# Altium schematic sheet 电源.SchDoc
size A3
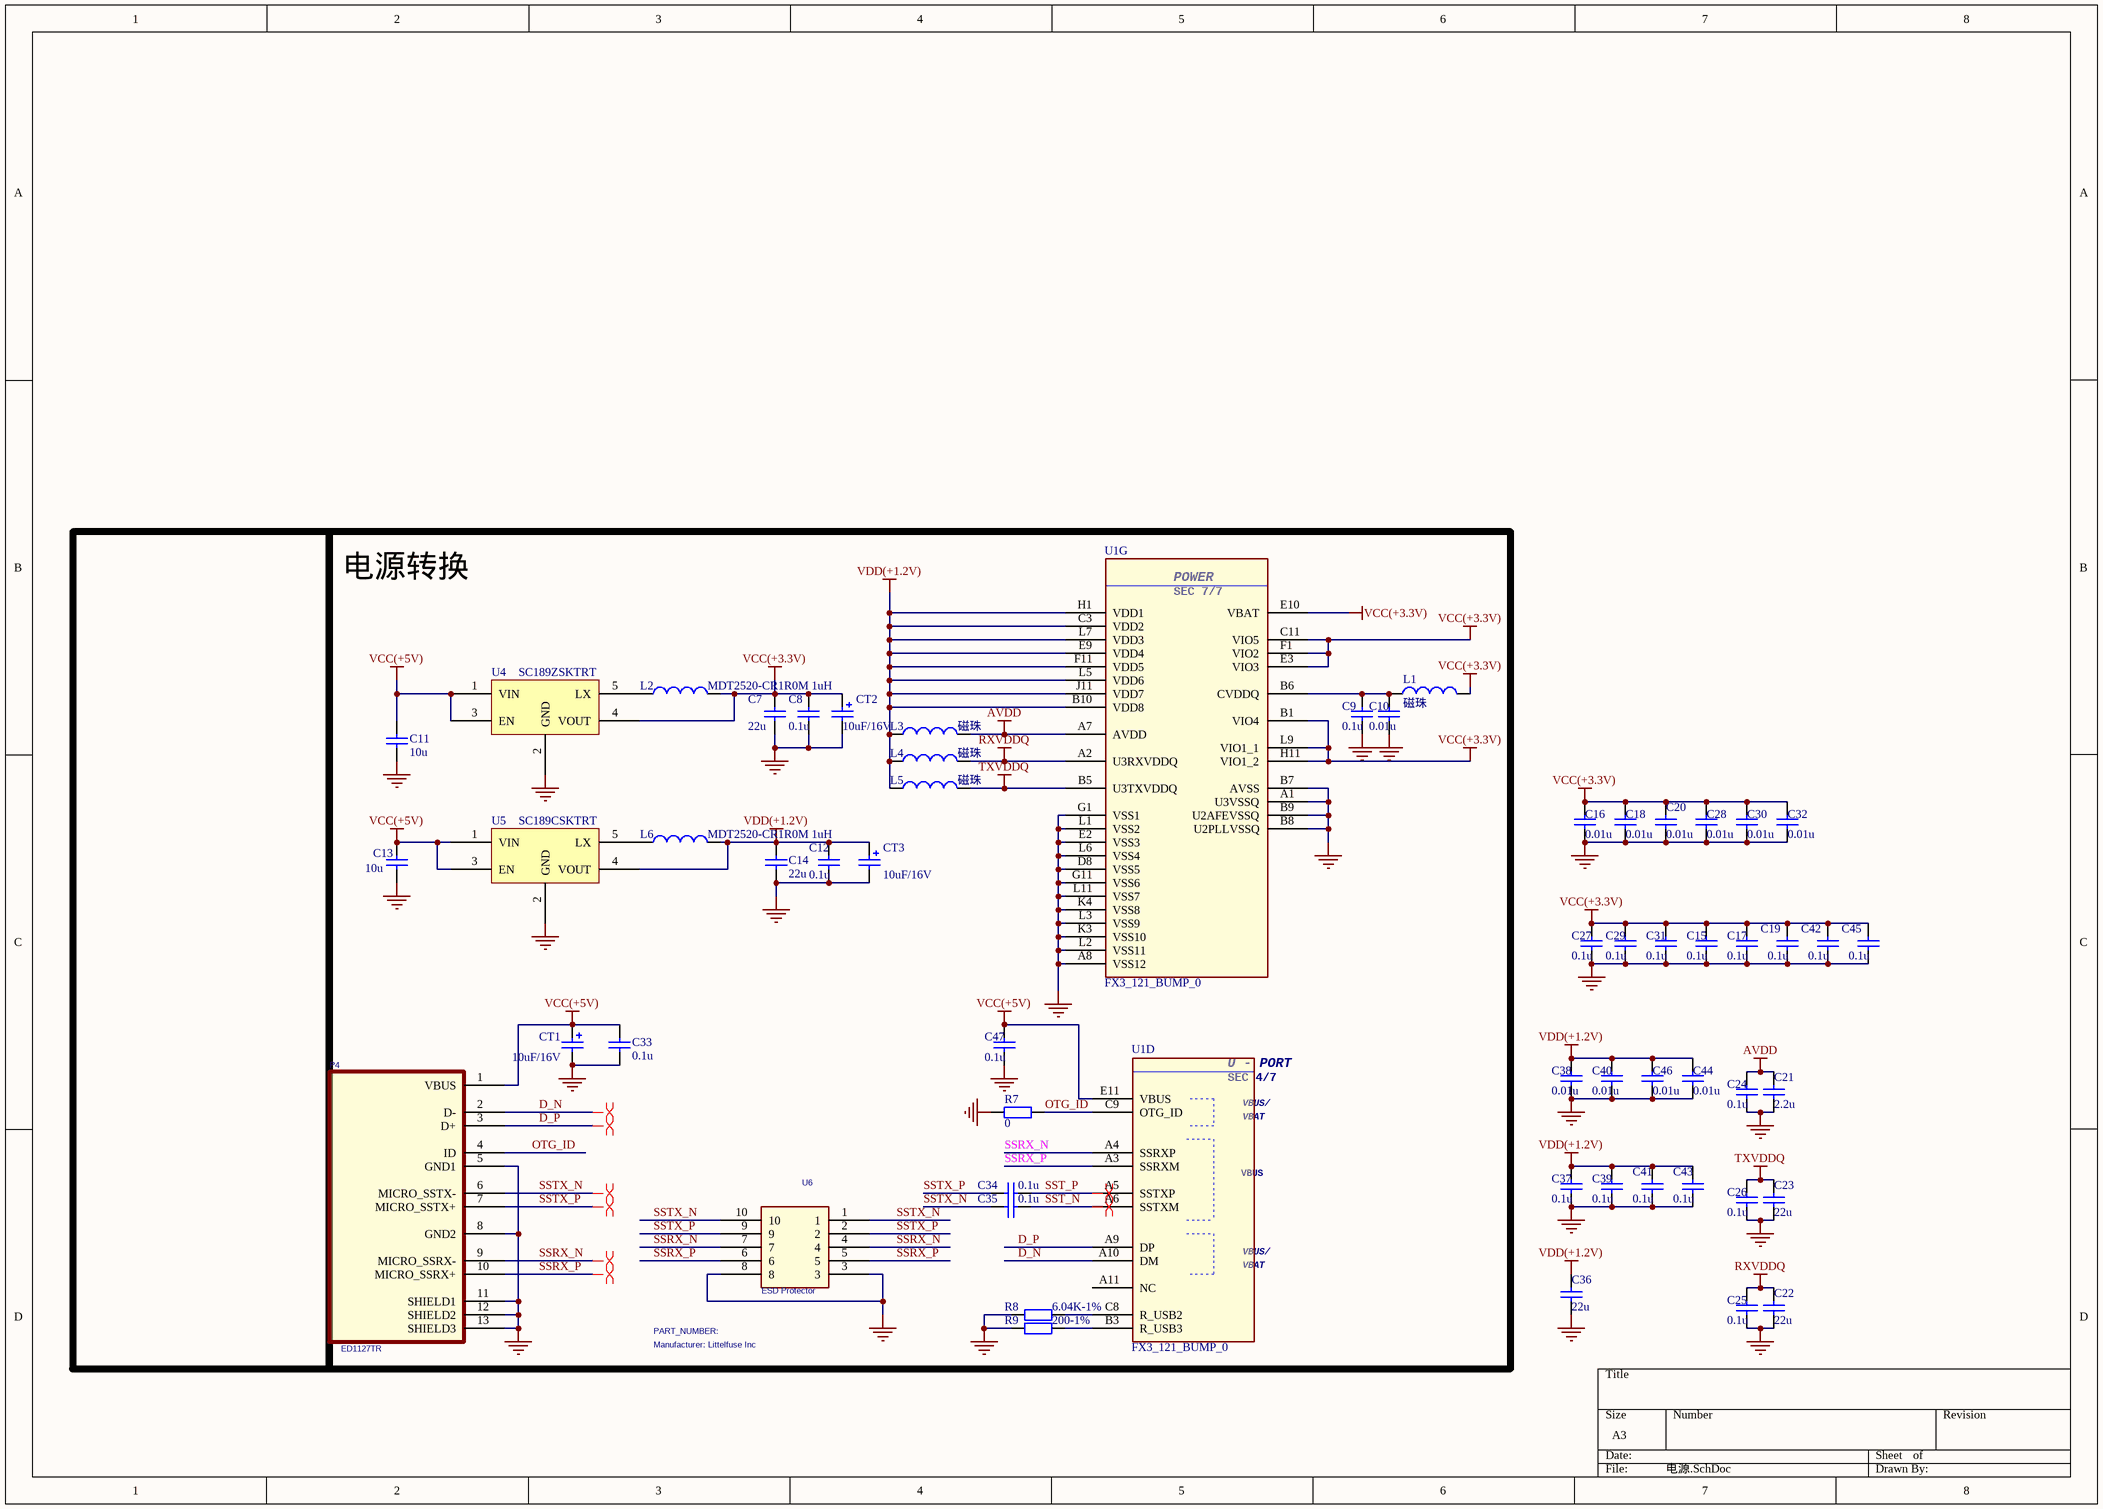
[diagram p0: 电源.SchDoc]

## Parts
C7  22u  [C0805S-CAP]
C8  0.1u  [0603S-CAP]
C9  0.1u  [C0402]
C10  0.01u  [C0402]
C11  10u  [C0805S-CAP]
C12  0.1u  [0603S-CAP]
C13  10u  [C0805S-CAP]
C14  22u  [C0805S-CAP]
C15  0.1u  [C0402]
C16  0.01u  [C0402]
C17  0.1u  [C0402]
C18  0.01u  [C0402]
C19  0.1u  [C0402]
C20  0.01u  [C0402]
C21  2.2u  [C0805S-CAP]
C22  22u  [C0805S-CAP]
C23  22u  [C0805S-CAP]
C24  0.1u  [C0402]
C25  0.1u  [C0402]
C26  0.1u  [C0402]
C27  0.1u  [C0402]
C28  0.01u  [C0402]
C29  0.1u  [C0402]
C30  0.01u  [C0402]
C31  0.1u  [C0402]
C32  0.01u  [C0402]
C33  0.1u  [0603S-CAP]
C34  0.1u  [C0402]
C35  0.1u  [C0402]
C36  22u  [C0805S-CAP]
C37  0.1u  [C0402]
C38  0.01u  [C0402]
C39  0.1u  [C0402]
C40  0.01u  [C0402]
C41  0.1u  [C0402]
C42  0.1u  [C0402]
C43  0.1u  [C0402]
C44  0.01u  [C0402]
C45  0.1u  [C0402]
C46  0.01u  [C0402]
C47  0.1u  [C0402]
CT1  10uF/16V  [钽电容（A型）]
CT2  10uF/16V  [钽电容（A型）]
CT3  10uF/16V  [钽电容（A型）]
L1  磁珠  [L0603]
L2  MDT2520-CR1R0M 1uH  [L2520]
L3  磁珠  [L0603]
L4  磁珠  [L0603]
L5  磁珠  [L0603]
L6  MDT2520-CR1R0M 1uH  [L2520]
P4  ED1127TR  [ED1127TR]
R7  0  [0603S-RES]
R8  6.04K-1%  [0603S-RES]
R9  200-1%  [0603S-RES]
U1  FX3_121_BUMP_0  [121_BGA_FX3]  (parts D,G of 8)
U4  SC189ZSKTRT  [SOT23-5]
U5  SC189CSKTRT  [SOT23-5]
U6  ESD Protector  Manufacturer: Littelfuse Inc  [UDFN10_SP3010]

## Blocks framed on the sheet
电源转换: C7-C14 C33-C35 C47 CT1-CT3 L1-L6 P4 R7-R9 U1 U4-U6

## Nets
AVDD: C21.2 C24.1 L3.2 U1.A7(AVDD)
GND: C7.1 C8.2 C9.2 C10.2 C11.1 C12.2 C13.1 C14.1 C15.2 C16.2 C17.2 C18.2 C19.2 C20.2 C21.1 C22.1 C23.1 C24.2 C25.2 C26.2 C27.2 C28.2 C29.2 C30.2 C31.2 C32.2 C33.2 C36.1 C37.2 C38.2 C39.2 C40.2 C41.2 C42.2 C43.2 C44.2 C45.2 C46.2 C47.2 CT1.2 CT2.2 CT3.2 P4.5(GND1) P4.8(GND2) P4.11(SHIELD1) P4.12(SHIELD2) P4.13(SHIELD3) R7.2 R8.2 R9.2 U1.A1(U3VSSQ) U1.A8(VSS12) U1.B7(AVSS) U1.B8(U2PLLVSSQ) U1.B9(U2AFEVSSQ) U1.D8(VSS5) U1.E2(VSS3) U1.G1(VSS1) U1.G11(VSS6) U1.K3(VSS10) U1.K4(VSS8) U1.L1(VSS2) U1.L2(VSS11) U1.L3(VSS9) U1.L6(VSS4) U1.L11(VSS7) U4.2(GND) U5.2(GND) U6.3 U6.8
RXVDDQ: C22.2 C25.1 L4.2 U1.A2(U3RXVDDQ)
TXVDDQ: C23.2 C26.1 L5.2 U1.B5(U3TXVDDQ)
VCC(+3.3V): C7.2 C8.1 C15.1 C16.1 C17.1 C18.1 C19.1 C20.1 C27.1 C28.1 C29.1 C30.1 C31.1 C32.1 C42.1 C45.1 CT2.1 L1.2 L2.2 U1.B1(VIO4) U1.C11(VIO5) U1.E3(VIO3) U1.E10(VBAT) U1.F1(VIO2) U1.H11(VIO1_2) U1.L9(VIO1_1) U4.4(VOUT)
VCC(+5V): C11.2 C13.2 C33.1 C47.1 CT1.1 P4.1(VBUS) U1.E11(VBUS) U4.1(VIN) U4.3(EN) U5.1(VIN) U5.3(EN)
VDD(+1.2V): C12.1 C14.2 C36.2 C37.1 C38.1 C39.1 C40.1 C41.1 C43.1 C44.1 C46.1 CT3.1 L3.1 L4.1 L5.1 L6.2 U1.B10(VDD8) U1.C3(VDD2) U1.E9(VDD4) U1.F11(VDD5) U1.H1(VDD1) U1.J11(VDD7) U1.L5(VDD6) U1.L7(VDD3) U5.4(VOUT)
D_N: P4.2(D-) U1.A10(DM)
D_P: P4.3(D+) U1.A9(DP)
OTG_ID: P4.4(ID) R7.1 U1.C9(OTG_ID)
SSRX_N: P4.9(MICRO_SSRX-) U1.A4(SSRXP) U6.4 U6.7
SSRX_P: P4.10(MICRO_SSRX+) U1.A3(SSRXM) U6.5 U6.6
SST_N: C35.2 U1.A6(SSTXM)
SST_P: C34.2 U1.A5(SSTXP)
SSTX_N: C35.1 P4.6(MICRO_SSTX-) U6.1 U6.10
SSTX_P: C34.1 P4.7(MICRO_SSTX+) U6.2 U6.9
NetC9_1: C9.1 C10.1 L1.1 U1.B6(CVDDQ)
NetL2_1: L2.1 U4.5(LX)
NetL6_1: L6.1 U5.5(LX)
NetR8_1: R8.1 U1.C8(R_USB2)
NetR9_1: R9.1 U1.B3(R_USB3)

Not connected (* = marked no-connect by the designer): U1 A11(NC)

## Layout directives
differential pair: D_N, D_P, SSRX_N, SSRX_P, SST_N, SST_P, SSTX_N, SSTX_P

## Notes on the sheet
- (in symbol FX3_121_BUMP_0, part D) U - PORT; SEC 4/7; VBUS/
- (in symbol FX3_121_BUMP_0, part G) POWER; SEC 7/7

## Library data of the parts
C7-C12 C14-C47 = CAP0805: Capacitor; Value: 104; Published: 8-Jun-2000; Publisher: Altium Limited; Revision: July-2002: Re-released for DXP Platform.
C13 = Cap: Capacitor; Value: 0.1u; Published: 8-Jun-2000; LatestRevisionDate: 17-Jul-2002; LatestRevisionNote: Re-released for DXP Platform.; PackageReference: RAD-0.3; Publisher: Altium Limited
CT1-CT3 = Cap Pol2: Polarized Capacitor (Axial); Value: 100pF; Published: 8-Jun-2000; LatestRevisionDate: 17-Jul-2002; LatestRevisionNote: Re-released for DXP Platform.; PackageReference: POLAR0.8; Publisher: Altium Limited
L1-L6 = Inductor: Code_IEC: 1005; Value: 10mH; Published: 8-Jun-2000; LatestRevisionDate: 29-May-2009; LatestRevisionNote: IPC-7351 Footprint Added.; PackageReference: 0402-A; Publisher: Altium Limited; PackageDescription: Chip Inductor; Code_JEITA: 0402
P4 = GSB343133HR_2: CONN RCPT USB 3.0 MICRO-B SMD; DEVICE: J48
R7-R9 = Res2: Resistor; Value: 10K; Published: 8-Jun-2000; LatestRevisionDate: 17-Jul-2002; LatestRevisionNote: Re-released for DXP Platform.; PackageReference: AXIAL-0.4; Publisher: Altium Limited
U4 U5 = PAM3101DAB150
U6 = AZ1065-06Q_0: TVS DIODE 6VWM 12.3VC UDFN; Part Number: SP3010-04UTG